# Altium schematic sheet PWR2.SchDoc
size A4; SheetNumber: 4
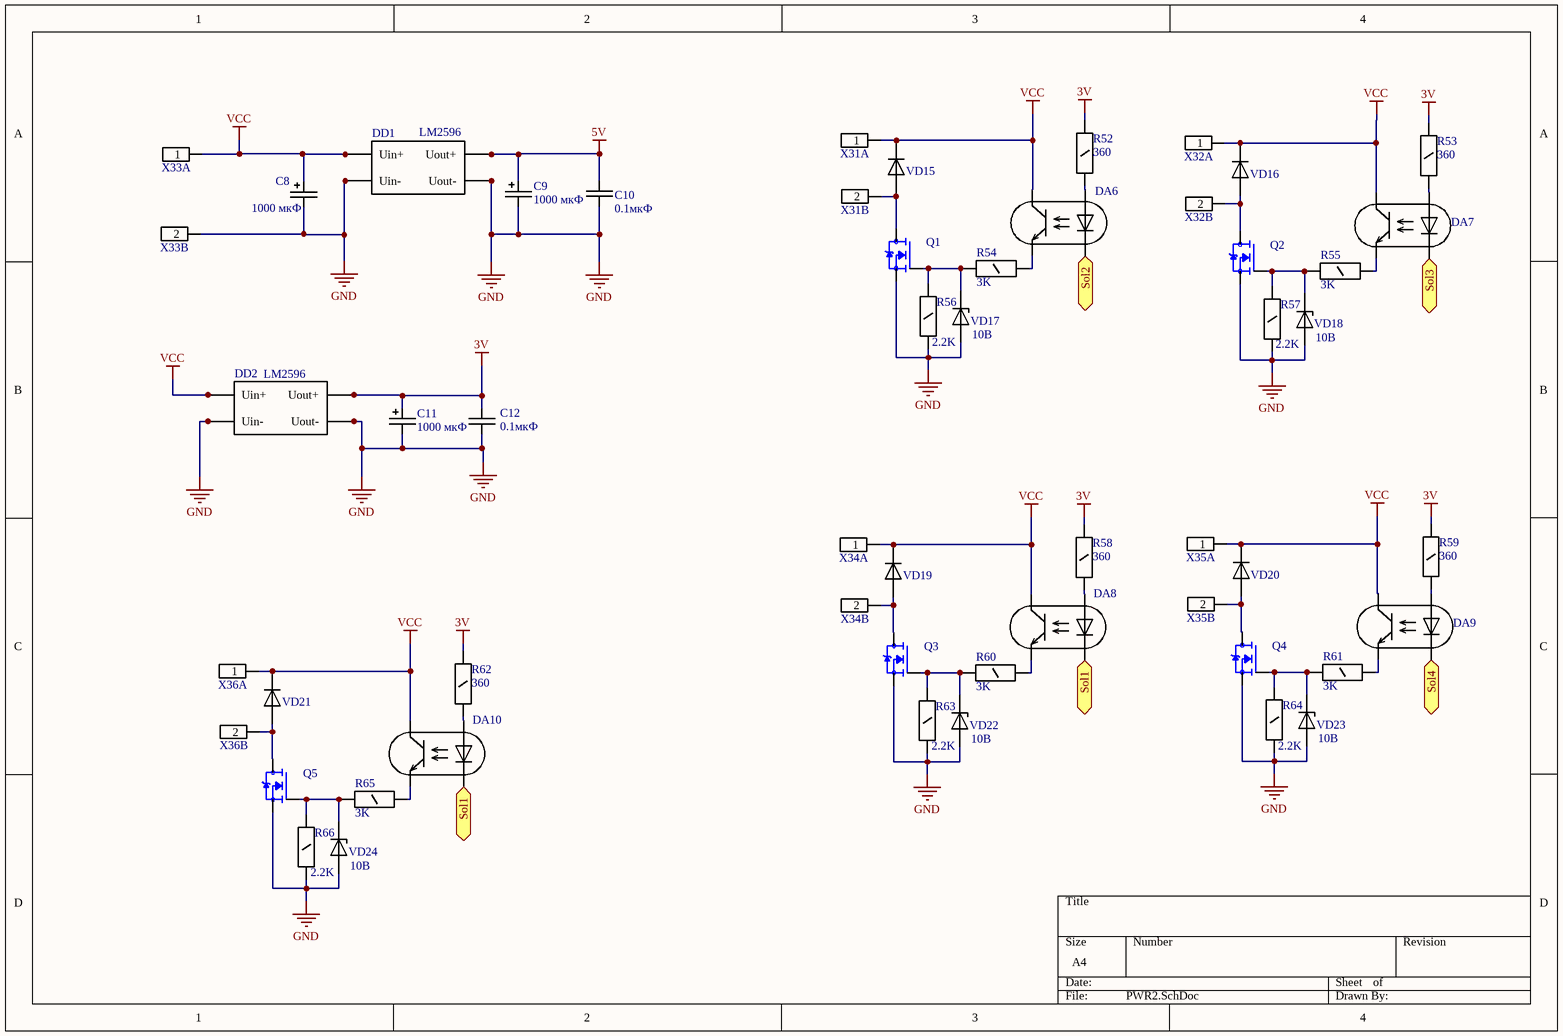
[diagram p0: PWR2.SchDoc]

## Parts
C8  1000 мкФ  [C_10x5]
C9  1000 мкФ  [C_10x5]
C10  0.1мкФ  [C_1206]
C11  1000 мкФ  [C_10x5]
C12  0.1мкФ  [C_1206]
DA6  KPC357NT0C  [Mini-flat-4]  (value not drawn)
DA7  KPC357NT0C  [Mini-flat-4]  (value not drawn)
DA8  KPC357NT0C  [Mini-flat-4]  (value not drawn)
DA9  KPC357NT0C  [Mini-flat-4]  (value not drawn)
DA10  KPC357NT0C  [Mini-flat-4]  (value not drawn)
DD1  LM2596  [LM2596]
DD2  LM2596  [LM2596]
Q1  IRFZ44N  [DPAK254P1524X483-3N]  (value not drawn)
Q2  IRFZ44N  [DPAK254P1524X483-3N]  (value not drawn)
Q3  IRFZ44N  [DPAK254P1524X483-3N]  (value not drawn)
Q4  IRFZ44N  [DPAK254P1524X483-3N]  (value not drawn)
Q5  IRFZ44N  [DPAK254P1524X483-3N]  (value not drawn)
R52  360  [R_1206]
R53  360  [R_1206]
R54  3K  [R_1206]
R55  3K  [R_1206]
R56  2.2K  [R_1206]
R57  2.2K  [R_1206]
R58  360  [R_1206]
R59  360  [R_1206]
R60  3K  [R_1206]
R61  3K  [R_1206]
R62  360  [R_1206]
R63  2.2K  [R_1206]
R64  2.2K  [R_1206]
R65  3K  [R_1206]
R66  2.2K  [R_1206]
VD15  SMA400*  [SMA (DO-214AC)]  (value not drawn)
VD16  SMA400*  [SMA (DO-214AC)]  (value not drawn)
VD17  10В  [DL-35]
VD18  10В  [DL-35]
VD19  SMA400*  [SMA (DO-214AC)]  (value not drawn)
VD20  SMA400*  [SMA (DO-214AC)]  (value not drawn)
VD21  SMA400*  [SMA (DO-214AC)]  (value not drawn)
VD22  10В  [DL-35]
VD23  10В  [DL-35]
VD24  10В  [DL-35]
X31  DG508V-02  [DG508V-02]  (value not drawn)  (parts A,B of 2)
X32  DG508V-02  [DG508V-02]  (value not drawn)  (parts A,B of 2)
X33  DG508V-02  [DG508V-02]  (value not drawn)  (parts A,B of 2)
X34  DG508V-02  [DG508V-02]  (value not drawn)  (parts A,B of 2)
X35  DG508V-02  [DG508V-02]  (value not drawn)  (parts A,B of 2)
X36  DG508V-02  [DG508V-02]  (value not drawn)  (parts A,B of 2)

## Ports
Sol1, Sol2, Sol3, Sol4

## Nets
3V: C11.1 C12.1 DD2.5(Uout+) DD2.6(Uout+) R52.1 R53.1 R58.1 R59.1 R62.1
5V: C9.1 C10.1 DD1.5(Uout+) DD1.6(Uout+)
GND: C8.2 C9.2 C10.2 C11.2 C12.2 DD1.3(Uin-) DD1.4(Uin-) DD1.7(Uout-) DD1.8(Uout-) DD2.3(Uin-) DD2.4(Uin-) DD2.7(Uout-) DD2.8(Uout-) Q1.3(S) Q2.3(S) Q3.3(S) Q4.3(S) Q5.3(S) R56.1 R57.1 R63.1 R64.1 R66.1 VD17.1 VD18.1 VD22.1 VD23.1 VD24.1 X33.2
VCC: C8.1 DA6.4 DA7.4 DA8.4 DA9.4 DA10.4 DD1.1(Uin+) DD1.2(Uin+) DD2.1(Uin+) DD2.2(Uin+) VD15.K VD16.K VD19.K VD20.K VD21.K X31.1 X32.1 X33.1 X34.1 X35.1 X36.1
Sol1: DA8.2 DA10.2 ; port Sol1
Sol2: DA6.2 ; port Sol2
Sol3: DA7.2 ; port Sol3
Sol4: DA9.2 ; port Sol4
NetDA6_1: DA6.1 R52.2
NetDA6_3: DA6.3 R54.2
NetDA7_1: DA7.1 R53.2
NetDA7_3: DA7.3 R55.2
NetDA8_1: DA8.1 R58.2
NetDA8_3: DA8.3 R60.2
NetDA9_1: DA9.1 R59.2
NetDA9_3: DA9.3 R61.2
NetDA10_1: DA10.1 R62.2
NetDA10_3: DA10.3 R65.2
NetQ1_1: Q1.1(G) R54.1 R56.2 VD17.2
NetQ1_2: Q1.2(D) VD15.A X31.2
NetQ2_1: Q2.1(G) R55.1 R57.2 VD18.2
NetQ2_2: Q2.2(D) VD16.A X32.2
NetQ3_1: Q3.1(G) R60.1 R63.2 VD22.2
NetQ3_2: Q3.2(D) VD19.A X34.2
NetQ4_1: Q4.1(G) R61.1 R64.2 VD23.2
NetQ4_2: Q4.2(D) VD20.A X35.2
NetQ5_1: Q5.1(G) R65.1 R66.2 VD24.2
NetQ5_2: Q5.2(D) VD21.A X36.2

## Library data of the parts
C8 C9 C11 = Конденсатор 25х12.5: К50-35; Tolerance: 20%; Type: Электролитический конденсатор; Life: 2000 часов; Name: К50-35; Value: 1000 мкФ; Mounting: в отверстие
C10 C12 = Конденсатор 1210: SMD; Name: 1210; Voltage: 50B; Tolerance: 10%; Type: Конденсатор ЧИП; Value: 0.1мкФ; Mounting: SMD
DA6-DA10 = KPC357NT: оптрон, SMD; Name: KPC357NT; Mounting: SMD
DD1 DD2 = LM2596: Блок питания; Mounting: в отверстие; Name: LM2596
Q1-Q5 = IRFZ44NSTRRPBF: N-Channel 55V 49A (Tc) 3.8W (Ta), 94W (Tc) Surface Mount D2PAK; MF: Infineon Technologies; Availability: Bad; Value: *; Check_prices: https://www.snapeda.com/parts/IRFZ44NSTRRPBF/Infineon%20Technologies/view-part/1356646/?ref=eda; Package: D2PAK Infineon; Price: None; MP: IRFZ44NSTRRPBF; SnapEDA_Link: https://www.snapeda.com/parts/IRFZ44NSTRRPBF/Infineon%20Technologies/view-part/1356646/?ref=snap
R52-R66 = Резистор 1206: 0,25 Вт; Name: 1206; Power: 0.25 Вт; Tolerance: 5%; Voltage: 200В; Type: Резистор ЧИП; Mounting: SMD
  R52 R53 R58 R59 R62: Value: 360
  R54 R55 R60 R61 R65: Value: 3K
  R56 R57 R63 R64 R66: Value: 2.2K
VD15 VD16 VD19-VD21 = SMA400*: диод, SMD; Max current: 1 А; Drop voltage: 1.1 В; Name: SMA400*; Mounting: SMD; Temperature: -65 .. +175; Max voltage: ?
VD17 VD18 VD22-VD24 = BZV55C***: стабилитрон, SMD; Power: 0.5 Вт; Name: BZV55C***; Mounting: SMD; Voltage: 10В; Temperature range: -55 ... +175
X31-X36 = DG508V-02: клеммник винтовой 2к.,5.08мм; Analog: MKDS 2/3; Name: DG508V-02; Type: шаг 5,08 мм; Mounting: в отверстие